# EasyEDA Pro project Output_Register.eprj

# Schematic Schematic1
Board Name: Board1; Create Date: 2025-08-19; Page Name: P1; Project Name: Output_Register; Schematic Name: Schematic1; Update Date: 2025-08-26; Company: EasyEDA.com; Page Size: A4; Version: V1.0
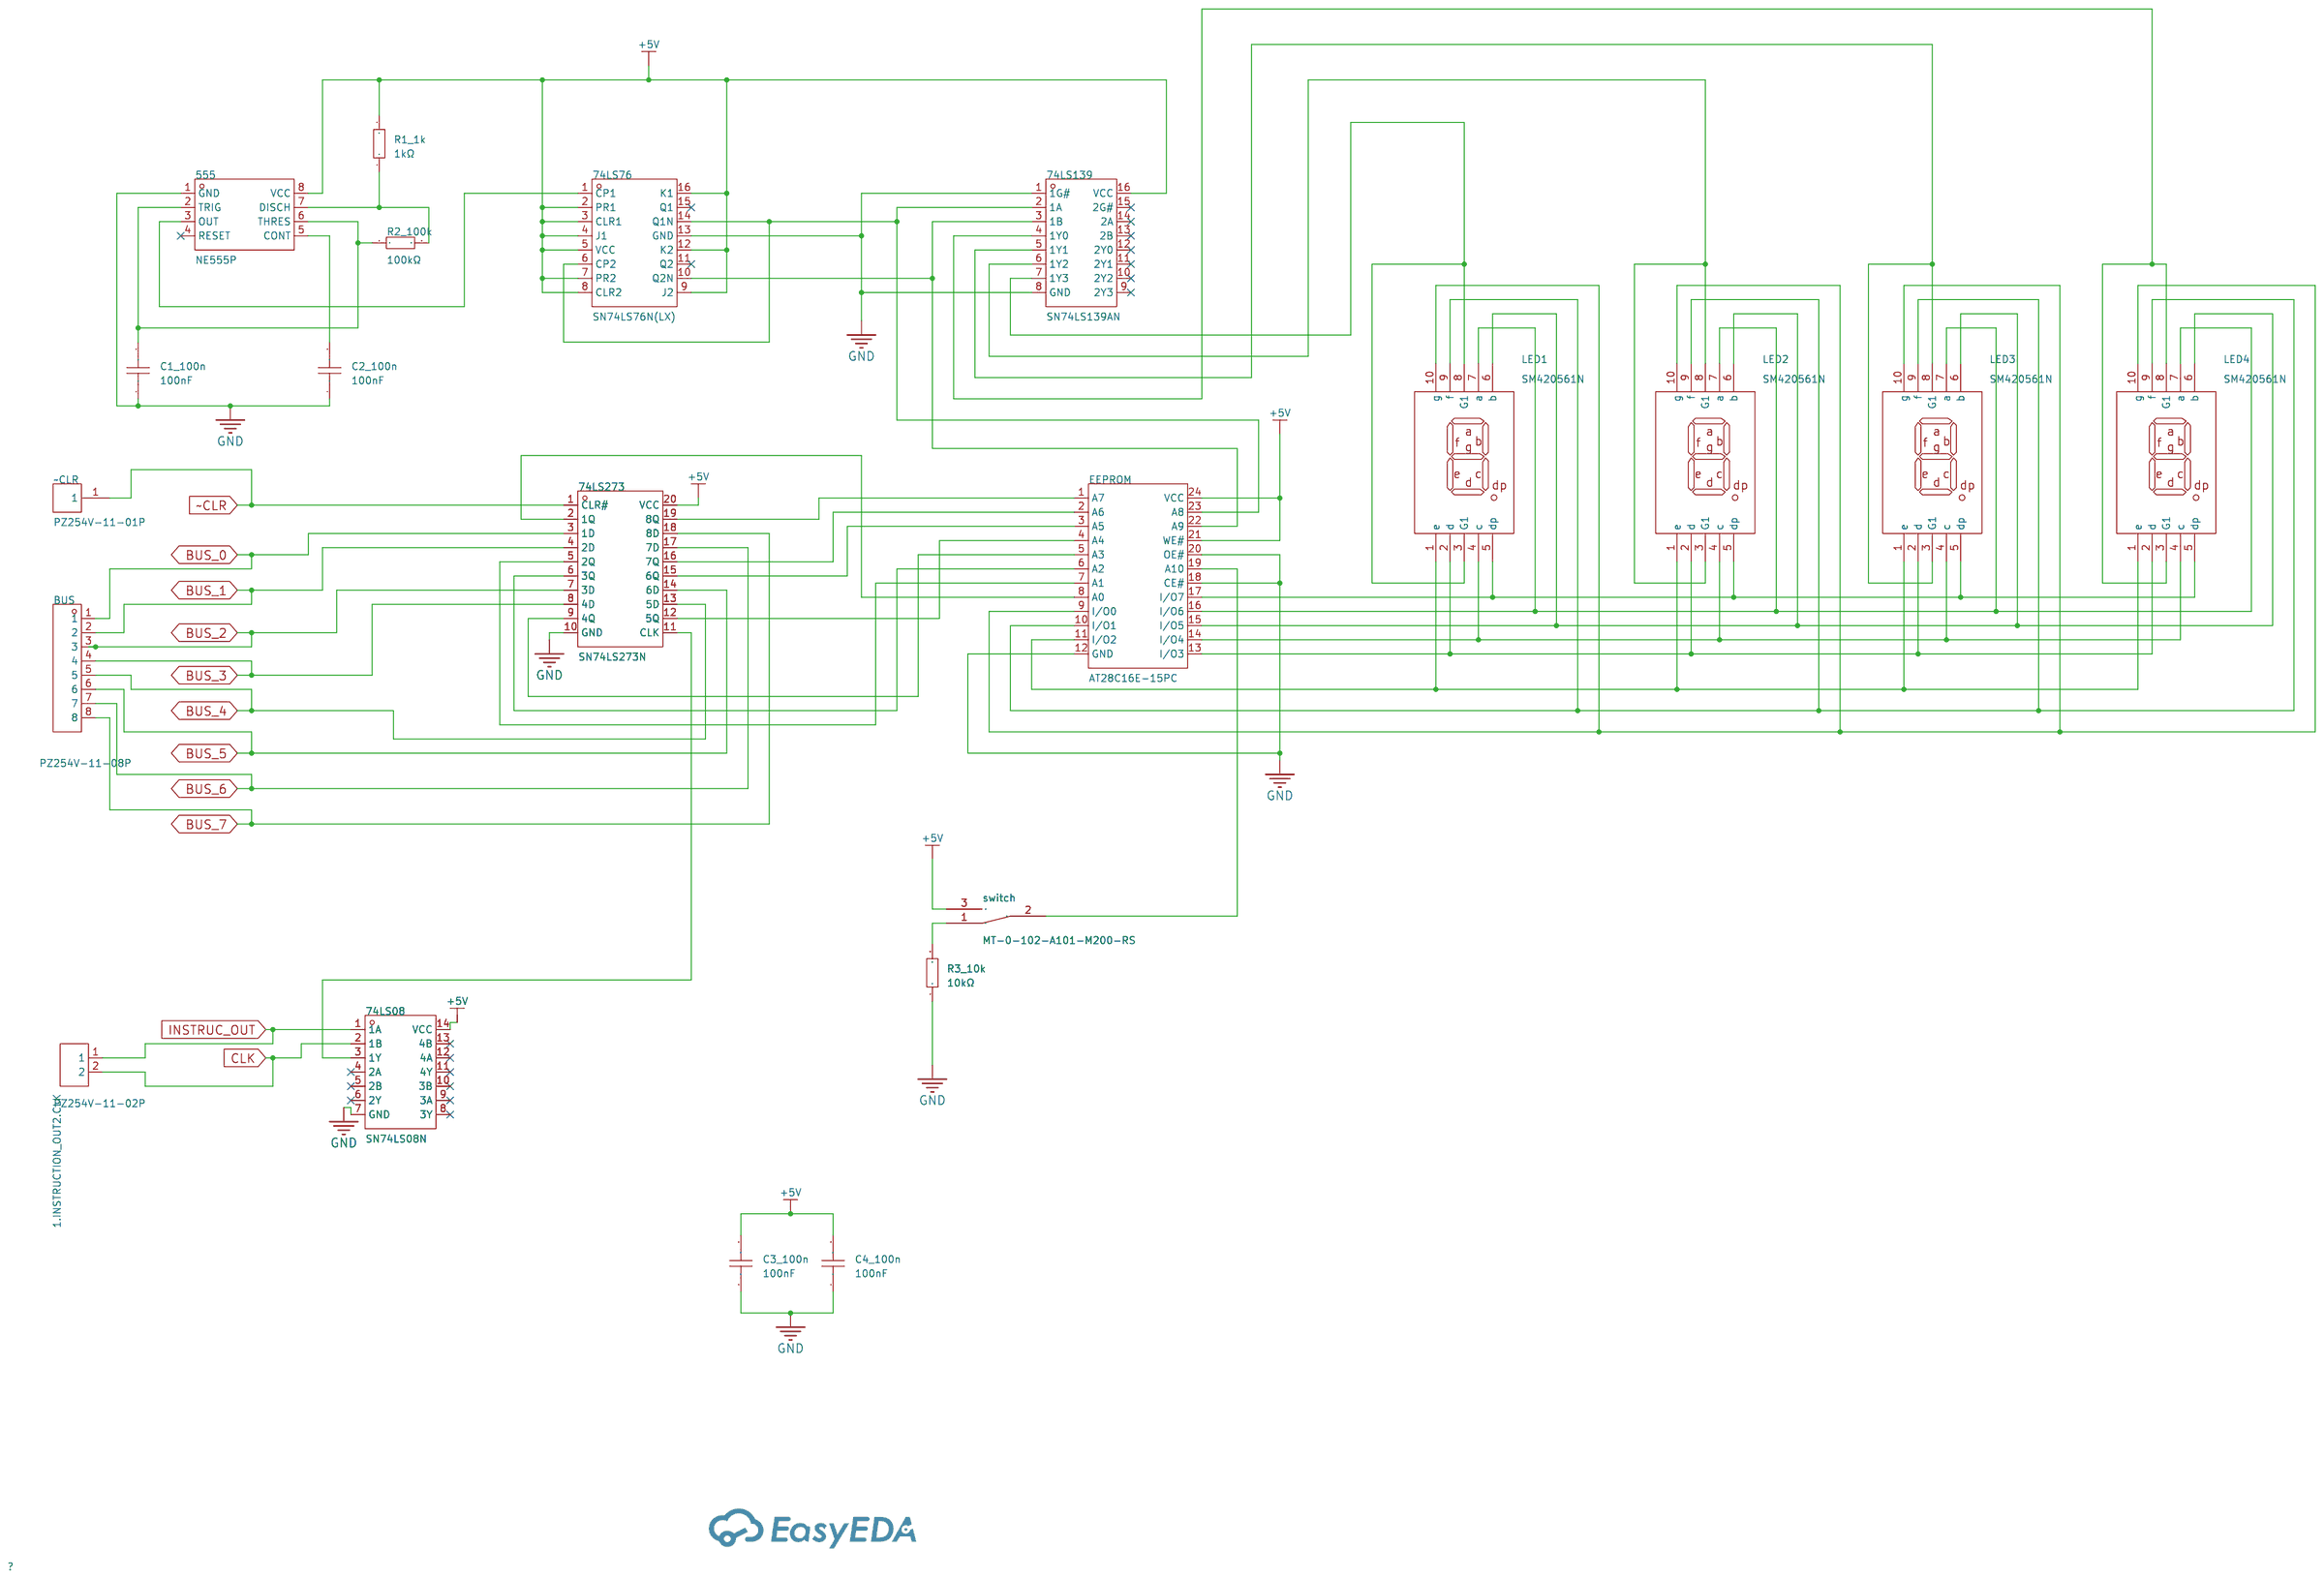
[diagram p0: schematic sheet]

## Parts
1.INSTRUCTION_OUT2.CLK  PZ254V-11-02P  [HDR-TH_2P-P2.54-V-M]
74LS08  SN74LS08N  [PDIP-14_L19.3-W6.4-P2.54-LS7.9-BL-1]
74LS76  SN74LS76N(LX)  [PDIP-16_L19.3-W6.4-P2.54-LS7.94-BL]
74LS139  SN74LS139AN  [PDIP-16_L19.3-W6.4-P2.54-LS7.9-BL]
74LS273  SN74LS273N  [PDIP-20_L25.4-W6.4-P2.54-LS7.6-BL]
555  NE555P  [DIP-8_L9.8-W6.6-P2.54-LS7.6-BL]
BUS  PZ254V-11-08P  [HDR-TH_8P-P2.54-V-M]
C1_100n  100nF  [CAP-TH_L8.5-W5.0-P5.00-D1.2]
C2_100n  100nF  [CAP-TH_L8.5-W5.0-P5.00-D1.2]
C3_100n  100nF  [CAP-TH_L8.5-W5.0-P5.00-D1.2]
C4_100n  100nF  [CAP-TH_L8.5-W5.0-P5.00-D1.2]
EEPROM  AT28C16E-15PC  [PDIP-24_L31.0-W13.5-P2.54-LS15.2-BL]
LED1  SM420561N  [LED-SEG-TH_10P-L12.7-W19.0-P2.54-S15.24-BL]
LED2  SM420561N  [LED-SEG-TH_10P-L12.7-W19.0-P2.54-S15.24-BL]
LED3  SM420561N  [LED-SEG-TH_10P-L12.7-W19.0-P2.54-S15.24-BL]
LED4  SM420561N  [LED-SEG-TH_10P-L12.7-W19.0-P2.54-S15.24-BL]
R1_1k  1kΩ  [R_AXIAL-0.4]
R2_100k  100kΩ  [R_AXIAL-0.4]
R3_10k  10kΩ  [R_AXIAL-0.4]
switch  MT-0-102-A101-M200-RS  [SW-TH_MT-0-103-A101-M200-RS]
~CLR  PZ254V-11-01P  [HDR-TH_1P-P2.54-V-M]

## Library data of the parts
1.INSTRUCTION_OUT2.CLK = PZ254V-11-02P: Pin Structure:1x2P Pitch:2.54mm Row Spacing:- Circluar Pins/Square Pins:Policy Mounting Type:Straight Number of Rows:Single Row Number of Pins:2P Current Rating:- Voltage Rating (Max):- Length of Mating Pin:6mm Insulation Height:2.5mm Length of End Connec; LCSC Part Name: 1x2P 间距:2.54mm 方针 直插; Supplier Part: C492401; Manufacturer: XFCN(兴飞); Supplier Footprint: 插件,P=2.54mm; JLCPCB Part Class: Extended Part; Datasheet: https://atta.szlcsc.com/upload/public/pdf/source/20200309/C492401_A812433581A9B211A7FFA413ADDFF0E5.pdf; Supplier: LCSC; Pin Structure: 1x2P; Pitch: 2.54mm; Circluar Pins/Square Pins: Policy; Mounting Type: Straight; Number of Rows: Single Row; Number of Pins: 2P; Length of Mating Pin: 6mm; Insulation Height: 2.5mm; Length of End Connection Pin: 3mm; Contact Material: Brass; Operating Temperature: -40℃~+105℃; Color: Black
74LS08 = SN74LS08N: Logic Type:AND Gate Number of Channels:4 Voltage - Supply:4.75V~5.25V Voltage - Supply:4.75V~5.25V Current - Output Low(IOL):8mA Current - Output High(IOH):400uA Input Logic Level - High:2V Input Logic Level - High:2V Input Logic Level - Low:800mV Input L; Supplier Part: C2869595; Manufacturer: TI(德州仪器); Supplier Footprint: PDIP-14; JLCPCB Part Class: Extended Part; Datasheet: https://www.ti.com/cn/lit/gpn/sn54s08; Supplier: LCSC; Logic Type: AND Gate; Number of Channels: 4; Voltage - Supply: 4.75V~5.25V; Current - Output Low(IOL): 8mA; Current - Output High(IOH): 400uA; Input Logic Level - High: 2V; Input Logic Level - Low: 800mV; Series: 74LSSeries; Operating Temperature: 0℃~+70℃
74LS76 = SN74LS76N(LX): Type:JK-Type Trigger Type:Falling Edge Voltage - Supply:2V~6V Voltage - Supply:2V~6V Clock Frequency:28MHz Output Type:Push-Pull Propagation Delay:- Series:74LS Series Quiescent Current:2uA Operating Temperature:-40℃~+125℃ Operating Temperature:-40℃~+125℃; Supplier Part: C41432856; Manufacturer: LX(灵星芯微); Supplier Footprint: DIP-16; Datasheet: https://atta.szlcsc.com/upload/public/pdf/source/20241021/03E57047579D06EC809D279D7674BE8E.pdf; Supplier: LCSC; Type: JK-Type; Trigger Type: Falling Edge; Voltage - Supply: 2V~6V; Clock Frequency: 28MHz; Output Type: Push-Pull; Series: 74LS Series; Quiescent Current: 2uA; Operating Temperature: -40℃~+125℃
74LS139 = SN74LS139AN: Type:Decoder/Demultiplexer Voltage Supply Source:Single Supply Voltage - Supply:4.75V~5.25V Voltage - Supply:4.75V~5.25V Current - Output Low(IOL):8mA Current - Output High(IOH):400uA Operating temperature:0℃~+70℃ Operating temperature:0℃~+70℃; Supplier Part: C1547281; Manufacturer: TI(德州仪器); Supplier Footprint: PDIP-16; JLCPCB Part Class: Extended Part; Datasheet: https://www.ti.com/cn/lit/gpn/sn74ls139a; Supplier: LCSC; Type: Decoder/Demultiplexer; Voltage Supply Source: Single Supply; Voltage - Supply: 4.75V~5.25V; Current - Output Low(IOL): 8mA; Current - Output High(IOH): 400uA; Operating temperature: 0℃~+70℃
74LS273 = SN74LS273N: Type:D-Type Trigger Type:Rising Edge Voltage - Supply:4.75V~5.25V Voltage - Supply:4.75V~5.25V Clock Frequency:40MHz Function:Reset Number of Elements:1 Number of Bits per Element:8 Output Type:- Propagation Delay:27ns@5V,15pF Series:74LS Series Current -; Supplier Part: C2879026; Manufacturer: TI(德州仪器); Supplier Footprint: PDIP-20; JLCPCB Part Class: Extended Part; Datasheet: https://www.ti.com/cn/lit/gpn/sn54ls273; Supplier: LCSC; Type: D-Type; Trigger Type: Rising Edge; Voltage - Supply: 4.75V~5.25V; Clock Frequency: 40MHz; Function: Reset; Number of Elements: 1; Number of Bits per Element: 8; Propagation Delay: 27ns@5V,15pF; Series: 74LS Series; Current - Output Low(IOL): 8mA; Current - Output High(IOH): 400uA; Quiescent Current: 27mA; Operating Temperature: 0℃~+70℃
555 = NE555P: Supplier Part: C46749; Manufacturer: TI(德州仪器); Supplier Footprint: DIP-8; JLCPCB Part Class: Extended Part; Datasheet: https://www.ti.com/cn/lit/gpn/ne555; Supplier: LCSC
BUS = PZ254V-11-08P: Pin Structure:1x8P Pitch:2.54mm Row Spacing:- Circluar Pins/Square Pins:Square Pins Mounting Type:Straight Number of Rows:Plugin Number of Pins:8P Current Rating (Max):- Voltage Rating (Max):- Length of Mating Pin:6mm Insulation Height:2.5mm Length of End; LCSC Part Name: 间距:2.54mm 1x8P 直插 方针; Supplier Part: C492407; Manufacturer: XFCN(兴飞); Supplier Footprint: 插件,P=2.54mm; JLCPCB Part Class: Extended Part; Datasheet: https://atta.szlcsc.com/upload/public/pdf/source/20200309/C492407_83A6FB26A2233368EDB9516968EC6149.pdf; Supplier: LCSC; Pin Structure: 1x8P; Pitch: 2.54mm; Circluar Pins/Square Pins: Square Pins; Mounting Type: Straight; Number of Rows: Plugin; Number of Pins: 8P; Length of Mating Pin: 6mm; Insulation Height: 2.5mm; Length of End Connection Pin: 3mm; Operating Temperature Range: -40℃~+105℃; Color: Black
C1_100n C2_100n C3_100n C4_100n = CT4-0805B104K500F3: Capacitance:100nF Tolerance:±10% Tolerance:±10% Voltage Rated: Temperature Coefficient:; LCSC Part Name: 100nF ±10% 50V C3型（直脚）; Supplier Part: C84772; Manufacturer: FH(风华); Supplier Footprint: 插件,P=5.08mm; JLCPCB Part Class: Extended Part; Datasheet: https://atta.szlcsc.com/upload/public/pdf/source/20190402/C385200_059806A6312B28FF1421A2413EB641E1.pdf; Supplier: LCSC; Tolerance: ±10%
EEPROM = AT28C16E-15PC: Supplier Part: C19393057; Manufacturer: MICROCHIP(美国微芯); Supplier Footprint: PDIP-24; JLCPCB Part Class: Extended Part; Datasheet: https://atta.szlcsc.com/upload/public/pdf/source/20231219/98B154FA288F53C07025EE50A49045E4.pdf; Supplier: LCSC
LED1-LED4 = SM420561N: Number of Characters:1Bit Display Type:7段 Module Size:19mmx12.6mmx8mm Power Dissipation:50mW Luminous Color:Red LED Polarity:共阴极 Digit/Alpha Size(inch):0.56; LCSC Part Name: 1位0.56英寸红色数码管 共阴极; Supplier Part: C141367; Manufacturer: ARKLED(方舟); Supplier Footprint: 插件; JLCPCB Part Class: Extended Part; Datasheet: https://atta.szlcsc.com/upload/public/pdf/source/20171116/C141367_15108221483041123770.pdf; Supplier: LCSC; Number of Characters: 1Bit; Display Type: 7段; Module Size: 19mmx12.6mmx8mm; Power Dissipation: 50mW; Luminous Color: Red; LED Polarity: 共阴极; Digit/Alpha Size(inch): 0.56
R1_1k R2_100k R3_10k = Res_AXIAL-1/4W: Supplier Footprint: Through
switch = MT-0-102-A101-M200-RS: Circuit:Single Pole Double Throw (SPDT) Switch Length:13mm Switch Width:8mm Switch Height:28.6mm Mechanical Life:- Contact Current:5A Voltage Rating (AC):125V Actuator Type:Cylinder knob Pin Style:Solder Mounting Style:Direct Insert Operating Temperature:; LCSC Part Name: 小型钮子三脚二档 五件套; Supplier Part: C1788492; Manufacturer: YUEN FUNG(源丰); Supplier Footprint: 插件; JLCPCB Part Class: Extended Part; Datasheet: https://atta.szlcsc.com/upload/public/pdf/source/20230720/8E5C36EFDF374AE4FF4AC09DB233CE0E.pdf; Supplier: LCSC; Circuit: Single Pole Double Throw (SPDT); Switch Length: 13mm; Switch Width: 8mm; Switch Height: 28.6mm; Contact Current: 5A; Voltage Rating (AC): 125V; Actuator Type: Cylinder knob; Pin Style: Solder; Mounting Style: Direct Insert; Operating Temperature: -25℃~+85℃
~CLR = PZ254V-11-01P: Pin Structure:1x1P Pitch:2.54mm Row Spacing:- Circluar Pins/Square Pins:Policy Mounting Type:Straight Number of Rows:Single Row Number of Pins:1P Current Rating:- Voltage Rating (Max):- Length of Mating Pin:6mm Insulation Height:2.5mm Length of End Connec; LCSC Part Name: 1x1P 间距:2.54mm 方针 直插; Supplier Part: C492400; Manufacturer: XFCN(兴飞); Supplier Footprint: 插件,P=2.54mm; JLCPCB Part Class: Extended Part; Datasheet: https://atta.szlcsc.com/upload/public/pdf/source/20200309/C492400_46876A5B545F5AE6B8D4A09C46E276E8.pdf; Supplier: LCSC; Pin Structure: 1x1P; Pitch: 2.54mm; Circluar Pins/Square Pins: Policy; Mounting Type: Straight; Number of Rows: Single Row; Number of Pins: 1P; Length of Mating Pin: 6mm; Insulation Height: 2.5mm; Length of End Connection Pin: 3mm; Contact Material: Brass; Operating Temperature: -40℃~+105℃; Color: Black

## Nets
+5V: 74LS08.14(VCC) 74LS76.2(PR1) 74LS76.3(CLR1) 74LS76.4(J1) 74LS76.5(VCC) 74LS76.7(PR2) 74LS76.8(CLR2) 74LS76.9(J2) 74LS76.12(K2) 74LS76.16(K1) 74LS139.16(VCC) 74LS273.20(VCC) 555.8(VCC) C3_100n.2 C4_100n.2 EEPROM.21(WE#) EEPROM.24(VCC) R1_1k.2 switch.3
GND: 74LS08.7(GND) 74LS76.13(GND) 74LS139.1(1G#) 74LS139.8(GND) 74LS273.10(GND) 555.1(GND) C1_100n.1 C2_100n.1 C3_100n.1 C4_100n.1 EEPROM.12(GND) EEPROM.18(CE#) EEPROM.20(OE#) R3_10k.1
BUS_0: 74LS273.3(1D) BUS.1
BUS_1: 74LS273.4(2D) BUS.2
BUS_2: 74LS273.7(3D) BUS.3
BUS_3: 74LS273.8(4D) BUS.4
BUS_4: 74LS273.13(5D) BUS.5
BUS_5: 74LS273.14(6D) BUS.6
BUS_6: 74LS273.17(7D) BUS.7
BUS_7: 74LS273.18(8D) BUS.8
CLK: 1.INSTRUCTION_OUT2.CLK.2 74LS08.2(1B)
INSTRUC_OUT: 1.INSTRUCTION_OUT2.CLK.1 74LS08.1(1A)
~CLR: 74LS273.1(CLR#) ~CLR.1
$1N1467: 555.5(CONT) C2_100n.2
$1N1468: 555.2(TRIG) 555.6(THRES) C1_100n.2 R2_100k.1
$1N1469: 555.7(DISCH) R1_1k.1 R2_100k.2
$1N1471: 74LS76.1(CP1) 555.3(OUT)
$1N1472: 74LS76.10(Q2N) 74LS139.3(1B) EEPROM.22(A9)
$1N1473: 74LS76.6(CP2) 74LS76.14(Q1N) 74LS139.2(1A) EEPROM.23(A8)
$1N1480: 74LS08.3(1Y) 74LS273.11(CLK)
$1N1483: 74LS273.2(1Q) EEPROM.8(A0)
$1N1484: 74LS273.5(2Q) EEPROM.7(A1)
$1N1485: 74LS273.6(3Q) EEPROM.6(A2)
$1N1486: 74LS273.9(4Q) EEPROM.5(A3)
$1N1487: 74LS273.12(5Q) EEPROM.4(A4)
$1N1488: 74LS273.15(6Q) EEPROM.3(A5)
$1N1489: 74LS273.16(7Q) EEPROM.2(A6)
$1N1490: 74LS273.19(8Q) EEPROM.1(A7)
$1N1495: EEPROM.9(I/O0) LED1.10(g) LED2.10(g) LED3.10(g) LED4.10(g)
$1N1496: EEPROM.10(I/O1) LED1.9(f) LED2.9(f) LED3.9(f) LED4.9(f)
$1N1497: EEPROM.11(I/O2) LED1.1(e) LED2.1(e) LED3.1(e) LED4.1(e)
$1N1498: EEPROM.13(I/O3) LED1.2(d) LED2.2(d) LED3.2(d) LED4.2(d)
$1N1499: EEPROM.14(I/O4) LED1.4(c) LED2.4(c) LED3.4(c) LED4.4(c)
$1N1500: EEPROM.15(I/O5) LED1.6(b) LED2.6(b) LED3.6(b) LED4.6(b)
$1N1501: EEPROM.16(I/O6) LED1.7(a) LED2.7(a) LED3.7(a) LED4.7(a)
$1N1502: EEPROM.17(I/O7) LED1.5(dp) LED2.5(dp) LED3.5(dp) LED4.5(dp)
$1N1503: 74LS139.5(1Y1) LED3.3(G1) LED3.8(G1)
$1N1504: 74LS139.6(1Y2) LED2.3(G1) LED2.8(G1)
$1N1505: 74LS139.7(1Y3) LED1.3(G1) LED1.8(G1)
$1N1506: 74LS139.4(1Y0) LED4.3(G1) LED4.8(G1)
$1N1511: R3_10k.2 switch.1
$1N1512: EEPROM.19(A10) switch.2

Not connected (* = marked no-connect by the designer): 74LS08 4(2A)* 5(2B)* 6(2Y)* 8(3Y)* 9(3A)* 10(3B)* 11(4Y)* 12(4A)* 13(4B)*; 74LS76 11(Q2)* 15(Q1)*; 74LS139 9(2Y3)* 10(2Y2)* 11(2Y1)* 12(2Y0)* 13(2B)* 14(2A)* 15(2G#)*; 555 4(RESET)*

# Board PCB1
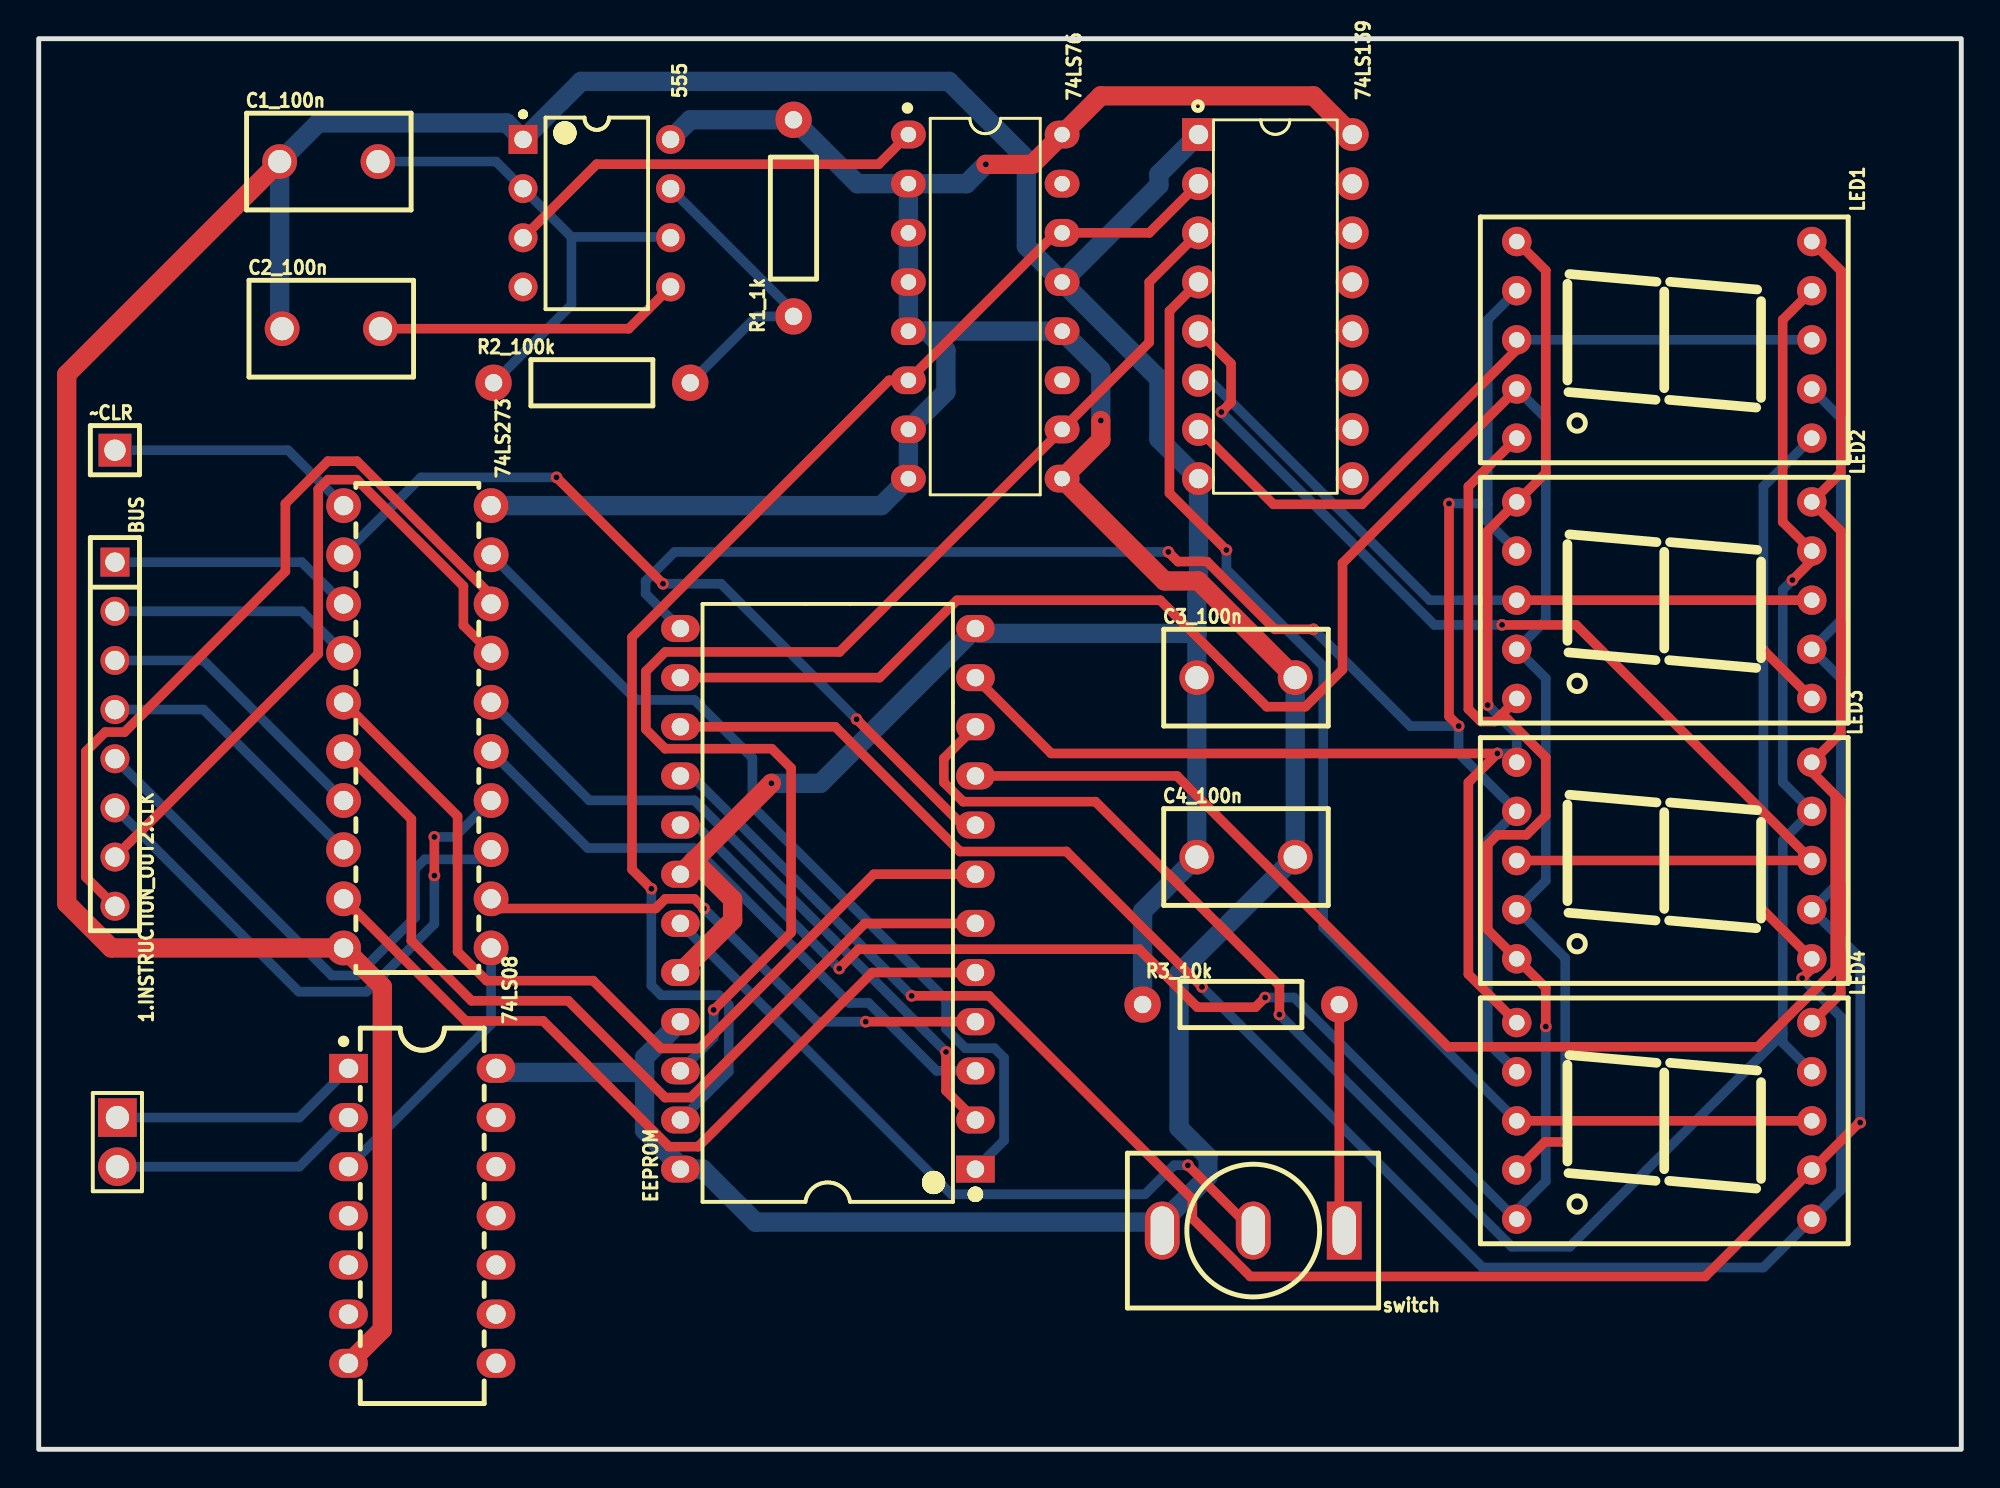
[diagram p1: board, top side]
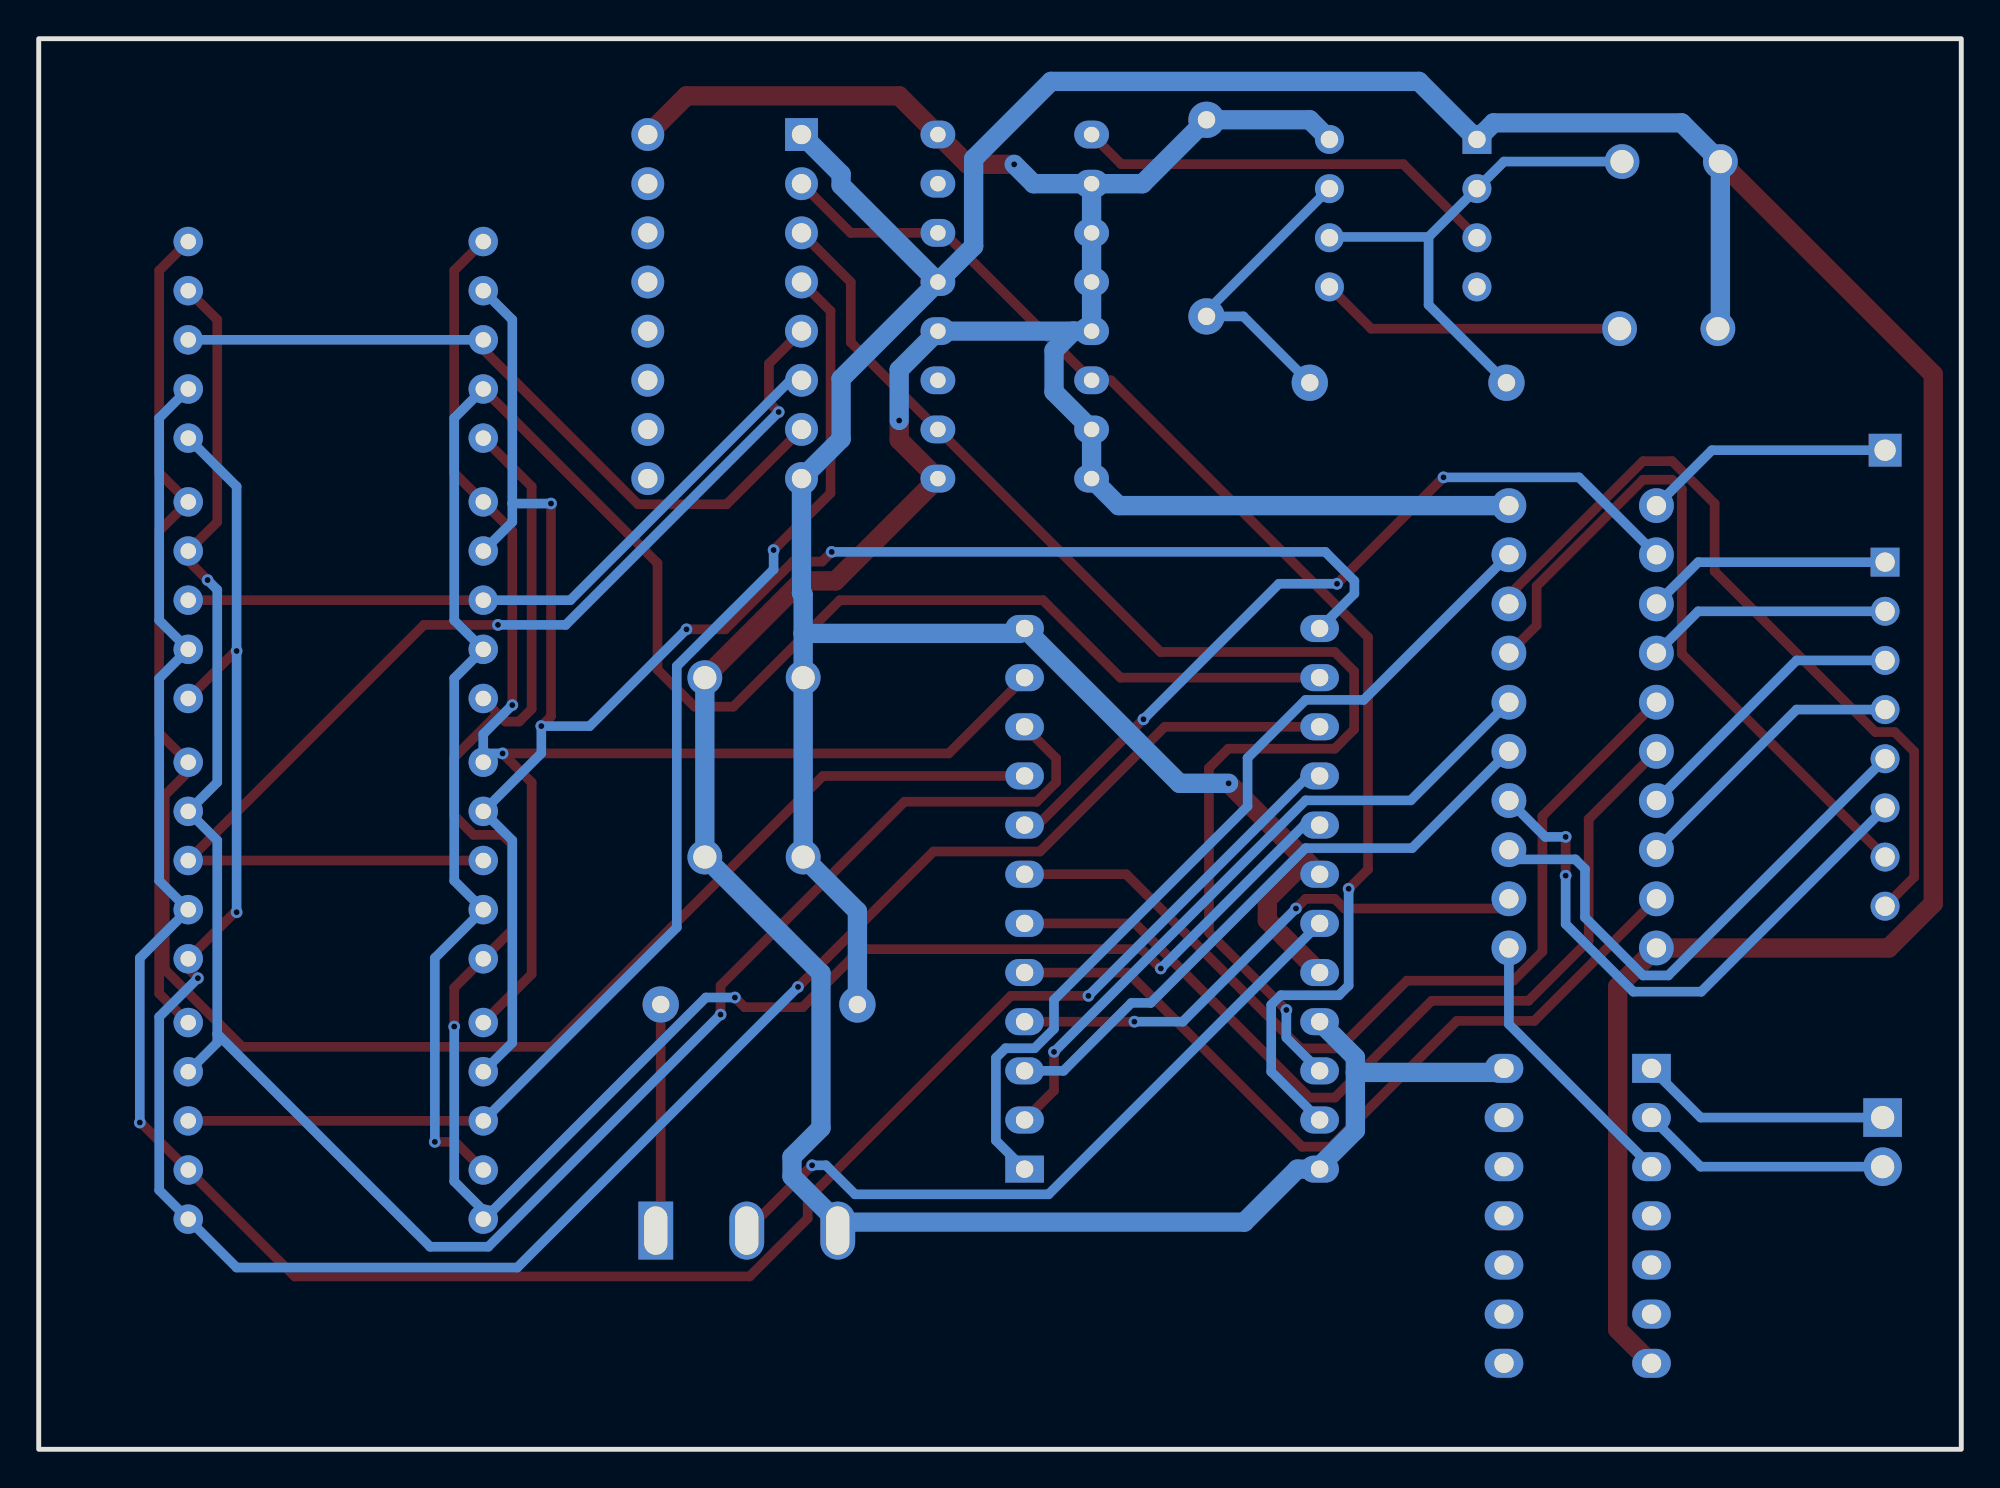
[diagram p2: board, bottom side, seen from below]

Outline 99.31 x 72.9 mm; copper layers: Top Layer, Bottom Layer. Coordinates in mm from the lower left corner of the outline.
Outline path: rectangle 0,72.9 99.31,0
Stack: Top Layer 0.035mm / Dielectric1 1.51mm FR4 er 4.5 / Bottom Layer 0.035mm

## Design rules (mm)
template: Custom Config
spacing copperThickness1oz (default): track to track 0.102, other pairs 0.152 to 0.3
spacing copperThickness2oz: track to track 0.203, other pairs 0.152 to 0.3
track width copperThickness1oz (default): min 0.127, default 0.5, max 2.54
track width copperThickness2oz: min 0.203, default 1, max 2.54
differential pair differentialPair (default): width min 0.127, default 0.254, max 2.54; gap min 0.152, default 0.152
via viaSize (default): diameter min 0.5, default 0.61, max 10; hole min 0.3, default 0.305, max 6.3
net GND uses copperThickness2oz
net +5V uses copperThickness2oz

## Placement (name value [footprint] x y rotation side)
1.INSTRUCTION_OUT2.CLK  PZ254V-11-02P  [HDR-TH_2P-P2.54-V-M]  4.06 15.88 270 top
74LS08  SN74LS08N  [PDIP-14_L19.3-W6.4-P2.54-LS7.9-BL-1]  19.81 12.06 270 top
74LS76  SN74LS76N(LX)  [PDIP-16_L19.3-W6.4-P2.54-LS7.94-BL]  48.89 59.05 270 top
74LS139  SN74LS139AN  [PDIP-16_L19.3-W6.4-P2.54-LS7.9-BL]  63.88 59.05 270 top
74LS273  SN74LS273N  [PDIP-20_L25.4-W6.4-P2.54-LS7.6-BL]  19.56 37.34 270 top
555  NE555P  [DIP-8_L9.8-W6.6-P2.54-LS7.6-BL]  28.83 63.88 270 top
BUS  PZ254V-11-08P  [HDR-TH_8P-P2.54-V-M]  3.94 36.96 270 top
C1_100n  100nF  [CAP-TH_L8.5-W5.0-P5.00-D1.2]  14.99 66.55 0 top
C2_100n  100nF  [CAP-TH_L8.5-W5.0-P5.00-D1.2]  15.11 57.91 0 top
C3_100n  100nF  [CAP-TH_L8.5-W5.0-P5.00-D1.2]  62.36 39.88 0 top
C4_100n  100nF  [CAP-TH_L8.5-W5.0-P5.00-D1.2]  62.36 30.61 0 top
EEPROM  AT28C16E-15PC  [PDIP-24_L31.0-W13.5-P2.54-LS15.2-BL]  40.77 28.45 90 top
LED1  SM420561N  [LED-SEG-TH_10P-L12.7-W19.0-P2.54-S15.24-BL]  83.97 57.34 270 top
LED2  SM420561N  [LED-SEG-TH_10P-L12.7-W19.0-P2.54-S15.24-BL]  83.97 43.88 270 top
LED3  SM420561N  [LED-SEG-TH_10P-L12.7-W19.0-P2.54-S15.24-BL]  83.97 30.43 270 top
LED4  SM420561N  [LED-SEG-TH_10P-L12.7-W19.0-P2.54-S15.24-BL]  83.97 16.97 270 top
R1_1k  1kΩ  [R_AXIAL-0.4]  38.99 63.63 90 top
R2_100k  100kΩ  [R_AXIAL-0.4]  28.58 55.12 0 top
R3_10k  10kΩ  [R_AXIAL-0.4]  62.1 22.99 0 top
switch  MT-0-102-A101-M200-RS  [SW-TH_MT-0-103-A101-M200-RS]  62.74 11.3 180 top
~CLR  PZ254V-11-01P  [HDR-TH_1P-P2.54-V-M]  3.94 51.63 0 top

## Footprints (pads in the part's own frame, mm; a bottom-side part is the same pattern mirrored in y, then rotated)
CAP-TH_L8.5-W5.0-P5.00-D1.2
  round 1.8 hole 1.2: 1(-2.54,0) 2(2.54,0)
DIP-8_L9.8-W6.6-P2.54-LS7.6-BL
  rect 1.5x1.5 hole 0.9: 1(-3.81,-3.81)
  round 1.5 hole 0.9: 2(-1.27,-3.81) 3(1.27,-3.81) 4(3.81,-3.81) 5(3.81,3.81) 6(1.27,3.81) 7(-1.27,3.81) 8(-3.81,3.81)
HDR-TH_1P-P2.54-V-M
  rect 1.7x1.7 hole 1.1: 1(0,0)
HDR-TH_2P-P2.54-V-M
  rect 2x2 hole 1.2: 1(-1.27,0)
  round 2 hole 1.2: 2(1.27,0)
HDR-TH_8P-P2.54-V-M
  rect 1.5x1.5 hole 1: 1(-8.89,0)
  round 1.5 hole 1: 2(-6.35,0) 3(-3.81,0) 4(-1.27,0) 5(1.27,0) 6(3.81,0) 7(6.35,0) 8(8.89,0)
LED-SEG-TH_10P-L12.7-W19.0-P2.54-S15.24-BL
  round 1.524 hole 0.8: 1(-5.08,-7.62) 2(-2.54,-7.62) 3(0,-7.62) 4(2.54,-7.62) 5(5.08,-7.62) 6(5.08,7.62) 7(2.54,7.62) 8(0,7.62) 9(-2.54,7.62) 10(-5.08,7.62)
PDIP-14_L19.3-W6.4-P2.54-LS7.9-BL-1
  rect 1.5x2 hole 1: 1(-7.62,-3.809)
  oval 1.5x2 hole 1: 2(-5.08,-3.81) 3(-2.54,-3.81) 4(0,-3.81) 5(2.54,-3.81) 6(5.08,-3.81) 7(7.62,-3.81) 8(7.62,3.81) 9(5.08,3.81) 10(2.54,3.81) 11(0,3.81) 12(-2.54,3.81) 13(-5.08,3.81) 14(-7.62,3.81)
PDIP-16_L19.3-W6.4-P2.54-LS7.9-BL
  rect 1.7x1.7 hole 1: 1(-8.89,-3.97)
  round 1.7 hole 1: 2(-6.35,-3.97) 3(-3.81,-3.97) 4(-1.27,-3.97) 5(1.27,-3.97) 6(3.81,-3.97) 7(6.35,-3.97) 8(8.89,-3.97) 9(8.89,3.97) 10(6.35,3.97) 11(3.81,3.97) 12(1.27,3.97) 13(-1.27,3.97) 14(-3.81,3.97) 15(-6.35,3.97) 16(-8.89,3.97)
PDIP-16_L19.3-W6.4-P2.54-LS7.94-BL
  oval 1.44x1.8 hole 0.8: 1(-8.89,-3.97) 2(-6.35,-3.97) 3(-3.81,-3.97) 4(-1.27,-3.97) 5(1.27,-3.97) 6(3.81,-3.97) 7(6.35,-3.97) 8(8.89,-3.97) 9(8.89,3.97) 10(6.35,3.97) 11(3.81,3.97) 12(1.27,3.97) 13(-1.27,3.97) 14(-3.81,3.97) 15(-6.35,3.97) 16(-8.89,3.97)
PDIP-20_L25.4-W6.4-P2.54-LS7.6-BL
  round 1.8 hole 1: 1(-11.43,-3.81) 2(-8.89,-3.81) 3(-6.35,-3.81) 4(-3.81,-3.81) 5(-1.27,-3.81) 6(1.27,-3.81) 7(3.81,-3.81) 8(6.35,-3.81) 9(8.89,-3.81) 10(11.43,-3.81) 11(11.43,3.81) 12(8.89,3.81) 13(6.35,3.81) 14(3.81,3.81) 15(1.27,3.81) 16(-1.27,3.81) 17(-3.81,3.81) 18(-6.35,3.81) 19(-8.89,3.81) 20(-11.43,3.81)
PDIP-24_L31.0-W13.5-P2.54-LS15.2-BL
  rect 1.4x2 hole 0.9: 1(-13.97,-7.62)
  oval 1.4x2 hole 0.9: 2(-11.43,-7.62) 3(-8.89,-7.62) 4(-6.35,-7.62) 5(-3.81,-7.62) 6(-1.27,-7.62) 7(1.27,-7.62) 8(3.81,-7.62) 9(6.35,-7.62) 10(8.89,-7.62) 11(11.43,-7.62) 12(13.97,-7.62) 13(13.97,7.62) 14(11.43,7.62) 15(8.89,7.62) 16(6.35,7.62) 17(3.81,7.62) 18(1.27,7.62) 19(-1.27,7.62) 20(-3.81,7.62) 21(-6.35,7.62) 22(-8.89,7.62) 23(-11.43,7.62) 24(-13.97,7.62)
R_AXIAL-0.4
  round 1.879 hole 0.899: 1(-5.08,0) 2(5.08,0)
SW-TH_MT-0-103-A101-M200-RS
  rect 1.8x3 hole 1.2x2.5: 1(-4.7,0)
  oval 1.8x3 hole 1.2x2.5: 2(0,0) 3(4.7,0)

## Nets
As in the schematic.

Pads without a net: 74LS08 4 5 6 8 9 10 11 12 13; 74LS76 11 15; 74LS139 9 10 11 12 13 14 15; 555 4

## Via types
v1: diameter 0.61, hole 0.305, Top Layer to Bottom Layer, 35 vias

## Routing (per net, layer and track width the routed paths; a pad name or vN(x,y) marks a point on that pad's centre or on a via; arc(x,y) is an arc through that point)
+5V: length 187.5
  Top Layer w1: C3_100n.2 59.9,44.88 58.15,44.88 74LS76.9 54.86,52.16 v1(54.86,53.16) ; 74LS139.16 65.85,69.94 54.86,69.94 74LS76.16 51.33,66.4 v1(48.92,66.4)
  Bottom Layer w1: v1(54.86,53.16) 54.86,55.78 74LS76.12 45.86,57.78 ; 58.04,11.74 switch.3 ; 58.04,11.74 37.04,11.74 34.3,14.48 33.3,14.48 ; 58.04,11.74 60.4,14.1 60.4,15.11 58.9,16.61 58.9,24.61 C4_100n.2 C3_100n.2 ; 555.8 33.65,68.71 R1_1k.2 42.29,65.4 74LS76.2 ; 23.37,48.77 43.53,48.77 74LS76.8 74LS76.7 46.86,54.64 46.86,56.78 45.86,57.78 ; 33.3,14.48 31.3,16.48 31.3,19.48 ; 33.3,14.48 33.15,14.48 ; 74LS08.14 23.83,19.48 31.3,19.48 ; 45.86,57.78 74LS76.5 74LS76.4 74LS76.3 74LS76.2 ; 74LS76.2 47.92,65.4 v1(48.92,66.4) ; 33.15,22.1 31.3,20.25 31.3,19.48
GND: length 231.4
  Top Layer w1: C1_100n.1 1.45,55.55 1.45,28.21 3.75,25.91 74LS273.10 17.75,23.91 17.75,6.19 74LS08.7 ; v1(37.85,34.42) 33.85,30.42 ; 33.85,30.42 35.85,28.42 35.85,27.34 33.15,24.64 ; 33.85,30.42 33.15,29.72
  Bottom Layer w1: 74LS76.13 57.86,55.32 57.86,52.21 74LS139.8 59.91,44.25 59.83,44.16 59.83,42.16 ; 74LS76.13 51.02,62.17 51.02,66.69 47.02,70.69 28.02,70.69 555.1 24.16,68.55 14.45,68.55 C1_100n.1 12.45,58.04 C2_100n.1 ; 74LS76.13 57.86,65.32 57.86,65.9 74LS139.1 ; v1(37.85,34.42) 40.39,34.42 EEPROM.12 48.64,42.16 59.83,42.16 ; 59.83,42.16 C3_100n.1 C4_100n.1 57.02,27.8 R3_10k.1
BUS_0: length 12.7
  Bottom Layer w0.5: 74LS273.3 13.59,45.85 BUS.1
BUS_1: length 12.7
  Bottom Layer w0.5: 15.75,41.15 13.59,43.31 BUS.2
BUS_2: length 14.8
  Bottom Layer w0.5: 74LS273.7 8.51,40.77 BUS.3
BUS_3: length 14.8
  Bottom Layer w0.5: 15.75,30.99 8.51,38.23 BUS.4
BUS_4: length 28.2
  Bottom Layer w0.5: 23.37,30.99 22.87,30.49 19.94,30.49 19.44,29.99 19.44,27.49 16.44,24.49 15.14,24.49 BUS.5
BUS_5: length 30.1
  Top Layer w0.5: v1(20.44,29.65) v1(20.44,31.65)
  Bottom Layer w0.5: 74LS273.14 21.49,31.65 v1(20.44,31.65) ; v1(20.44,29.65) 20.44,27.15 16.94,23.65 13.44,23.65 BUS.6
BUS_6: length 37.4
  Top Layer w0.5: 23.37,41.15 21.94,42.58 21.94,44.61 16.44,50.11 14.94,50.11 14.44,49.61 14.44,41.11 BUS.7
BUS_7: length 41.1
  Top Layer w0.5: 74LS273.18 23.37,44.14 16.44,51.07 14.94,51.07 12.74,48.87 12.74,45.37 4.44,37.07 3.44,37.07 2.44,36.07 2.44,29.57 BUS.8
CLK: length 13
  Bottom Layer w0.5: 1.INSTRUCTION_OUT2.CLK.2 13.46,14.6 74LS08.2
INSTRUC_OUT: length 13
  Bottom Layer w0.5: 1.INSTRUCTION_OUT2.CLK.1 13.46,17.14 74LS08.1
~CLR: length 13
  Bottom Layer w0.5: 15.75,48.77 12.88,51.63 ~CLR.1
$1N1467: length 15.9
  Top Layer w0.5: 17.65,57.91 30.48,57.91 555.5
$1N1468: length 25.9
  Bottom Layer w0.5: 27.52,62.65 27.52,59.14 R2_100k.1 ; 27.52,62.65 32.6,62.65 555.6 ; 27.52,62.65 555.2 23.62,66.55 C1_100n.2
$1N1469: length 16
  Bottom Layer w0.5: R2_100k.2 37.08,58.55 R1_1k.1 38.99,58.8 555.7
$1N1471: length 22.1
  Top Layer w0.5: 74LS76.1 43.39,66.41 28.82,66.41 555.3
$1N1472: length 69.1
  Top Layer w0.5: 74LS139.3 57.36,60.32 57.36,57.2 74LS76.10 41.36,41.2 32.36,41.2 31.36,40.2 31.36,37.2 32.36,36.2 37.86,36.2 38.86,35.2 38.86,26.7 v1(34.86,22.7)
  Bottom Layer w0.5: v1(34.86,22.7) 34.86,21.28 33.15,19.56
$1N1473: length 68.8
  Top Layer w0.5: 74LS139.2 57.37,62.86 74LS76.14 52.55,62.86 74LS76.6 43.92,55.24 30.65,41.97 30.65,29.97 v1(31.65,28.97)
  Bottom Layer w0.5: v1(31.65,28.97) 31.65,23.97 32.15,23.47 35.15,23.47 35.65,22.97 35.65,19.52 33.15,17.02
$1N1480: length 14.4
  Bottom Layer w0.5: 74LS08.3 23.37,21.97 74LS273.11
$1N1483: length 41.7
  Top Layer w0.5: v1(42.25,37.73) 47.72,32.26 EEPROM.8 ; v1(26.75,50.23) v1(32.25,44.73)
  Bottom Layer w0.5: v1(26.75,50.23) 19.75,50.23 74LS273.2 ; v1(42.25,37.73) 35.25,44.73 v1(32.25,44.73)
$1N1484: length 47.9
  Top Layer w0.5: EEPROM.7 43.14,29.72 34.14,20.72 32.14,20.72 28.64,24.22 23.14,24.22 21.64,25.72 21.64,32.72 74LS273.5
$1N1485: length 47.5
  Top Layer w0.5: EEPROM.6 42.68,27.18 33.68,18.18 32.36,18.18 27.36,23.18 22.36,23.18 19.25,26.29 19.25,32.57 15.75,36.07
$1N1486: length 41.7
  Top Layer w0.5: 74LS273.9 22.06,22.14 26.06,22.14 32.56,15.64 34.06,15.64 43.06,24.64 EEPROM.5
$1N1487: length 28.1
  Top Layer w0.5: 74LS273.12 23.87,27.95 31.87,27.95 32.37,28.45 33.87,28.45 v1(34.37,27.95) ; v1(42.72,22.1) EEPROM.4
  Bottom Layer w0.5: v1(42.72,22.1) 40.22,22.1 v1(34.37,27.95)
$1N1488: length 31.9
  Bottom Layer w0.5: EEPROM.3 46.38,19.56 42.87,23.07 41.87,23.07 33.87,31.07 28.37,31.07 23.37,36.07
$1N1489: length 35.1
  Top Layer w0.5: v1(46.87,20.54) 46.87,18.54 EEPROM.2
  Bottom Layer w0.5: 74LS273.16 28.44,33.54 33.87,33.54 v1(46.87,20.54)
$1N1490: length 46
  Bottom Layer w0.5: 74LS273.19 30.87,38.73 33.87,38.73 36.87,35.73 36.87,33.23 46.87,23.23 46.87,21.73 47.87,20.73 49.37,20.73 49.87,20.23 49.87,15.96 EEPROM.1
$1N1495: length 105
  Top Layer w0.5: LED1.10 93.09,60.92 93.09,50.46 LED2.10 93.09,47.46 93.09,37.01 LED3.10 91.59,35.01 92.8,33.8 ; 92.8,33.8 92.8,24.8 88.8,20.8 72.8,20.8 58.8,34.8 EEPROM.9 ; 92.8,33.8 93.09,33.51 93.09,23.55 LED4.10
$1N1496: length 106.3
  Top Layer w0.5: v1(90.59,44.92) 91.59,45.92 LED2.9 90.09,47.92 90.09,58.38 LED1.9 ; v1(64.09,22.47) 64.09,23.97 54.59,33.47 47.76,33.47 46.76,34.47 46.76,35.71 EEPROM.10
  Bottom Layer w0.5: v1(90.59,44.92) 90.09,44.42 90.09,34.47 LED3.9 90.09,31.47 90.09,21.47 ; 90.09,21.47 90.09,21.01 LED4.9 ; 90.09,21.47 79.09,10.47 76.09,10.47 v1(64.09,22.47)
$1N1497: length 74.5
  Top Layer w0.5: EEPROM.11 52.3,35.96 v1(75.35,35.96) 73.85,34.46 73.85,24.55 LED4.1 ; v1(74.85,38.46) 74.85,47.46 LED2.1 77.85,50.46 77.85,60.92 LED1.1
  Bottom Layer w0.5: v1(74.85,38.46) 76.35,36.96 76.35,35.96 ; 76.35,35.96 v1(75.35,35.96) ; 76.35,35.96 LED3.1
$1N1498: length 98.3
  Top Layer w0.5: v1(72.85,48.88) 72.85,37.88 v1(73.35,37.38) ; v1(65.85,42.38) 63.85,42.38 60.35,45.88 58.85,45.88 v1(58.35,46.38)
  Bottom Layer w0.5: LED1.2 74.85,58.38 74.85,48.88 ; LED4.2 74.85,21.01 74.85,31.47 LED3.2 73.35,35.97 v1(73.35,37.38) 70.85,37.38 v1(65.85,42.38) ; 74.85,48.88 74.85,47.92 LED2.2 ; 74.85,48.88 v1(72.85,48.88) ; 33.15,42.42 31.35,44.21 31.35,44.88 32.85,46.38 v1(58.35,46.38)
$1N1499: length 102.7
  Top Layer w0.5: LED4.4 77.8,15.89 v1(78.85,15.89) ; LED1.4 67.35,45.8 67.35,40.3 65.43,38.38 63.43,38.38 57.93,43.88 47.43,43.88 43.43,39.88 33.15,39.88
  Bottom Layer w0.5: LED1.4 77.85,53.3 77.85,42.84 LED2.4 77.85,39.84 77.85,29.39 LED3.4 78.85,25.39 v1(78.85,15.89)
$1N1500: length 118.7
  Top Layer w0.5: v1(60.09,23.89) 53.09,30.89 47.59,30.89 41.15,37.34 33.15,37.34 ; v1(89.09,27.76) 89.18,27.76 LED3.6 91.59,24.85 v1(91.09,24.35) ; v1(89.09,41.26) 89.14,41.26 LED2.6
  Bottom Layer w0.5: v1(60.09,23.89) 74.59,9.39 89.09,9.39 LED4.6 93.09,13.39 93.09,22.35 v1(91.09,24.35) ; LED1.6 89.09,49.76 v1(89.09,41.26) v1(89.09,27.76)
$1N1501: length 117
  Top Layer w0.5: v1(45.09,23.43) 49.09,23.43 59.59,12.93 59.59,11.93 62.59,8.93 86.09,8.93 LED4.7 94.05,16.89 v1(94.09,16.89)
  Bottom Layer w0.5: v1(45.09,23.43) 33.73,34.8 33.15,34.8 ; v1(94.09,16.89) 94.09,25.39 LED3.7 93.09,29.39 93.09,39.84 LED2.7 93.09,42.84 93.09,53.3 LED1.7
$1N1502: length 102.2
  Top Layer w0.5: 75.35,37.76 76.35,38.76 LED2.5 ; 75.35,37.76 75.2,37.61 74.5,37.61 73.85,38.26 73.85,49.76 LED1.5 ; 75.35,37.76 75.85,37.76 77.85,35.76 77.85,32.76 76.85,31.76 75.35,31.76 74.85,31.26 74.85,26.85 LED3.5 77.85,23.85 v1(77.85,21.85) ; v1(63.35,23.35) 62.85,22.85 59.85,22.85 56.85,25.85 42.35,25.85 v1(41.35,24.85)
  Bottom Layer w0.5: v1(63.35,23.35) 64.85,23.35 75.85,12.35 76.35,12.35 ; v1(41.35,24.85) 33.94,32.26 33.15,32.26 ; 76.35,12.35 77.85,13.85 v1(77.85,21.85) ; 76.35,12.35 LED4.5
$1N1503: length 60.4
  Top Layer w0.5: LED3.3 LED3.8 79.41,42.6 v1(75.59,42.6) ; 74LS139.5 61.59,56.1 61.59,54.1 v1(61.09,53.6)
  Bottom Layer w0.5: v1(61.09,53.6) 72.09,42.6 v1(75.59,42.6)
$1N1504: length 36.4
  Top Layer w0.5: LED2.3 LED2.8
  Bottom Layer w0.5: LED2.3 71.85,43.88 60.49,55.24 74LS139.6
$1N1505: length 37.1
  Top Layer w0.5: LED1.3 76.35,56.84 68.35,48.84 63.78,48.84 74LS139.7
  Bottom Layer w0.5: LED1.3 LED1.8
$1N1506: length 66.6
  Top Layer w0.5: 74LS139.4 58.41,58.82 58.41,49.41 v1(61.35,46.47) ; LED4.3 LED4.8
  Bottom Layer w0.5: v1(61.35,46.47) 61.35,45.47 66.35,40.47 66.35,26.97 LED4.3
$1N1511: length 11.8
  Top Layer w0.5: R3_10k.2 67.18,11.56 switch.1
$1N1512: length 37.4
  Top Layer w0.5: v1(59.36,14.68) switch.2
  Bottom Layer w0.5: 33.15,27.18 47.15,13.18 57.15,13.18 58.65,14.68 v1(59.36,14.68)
